# Altium project esp8266_relay.PrjPcb
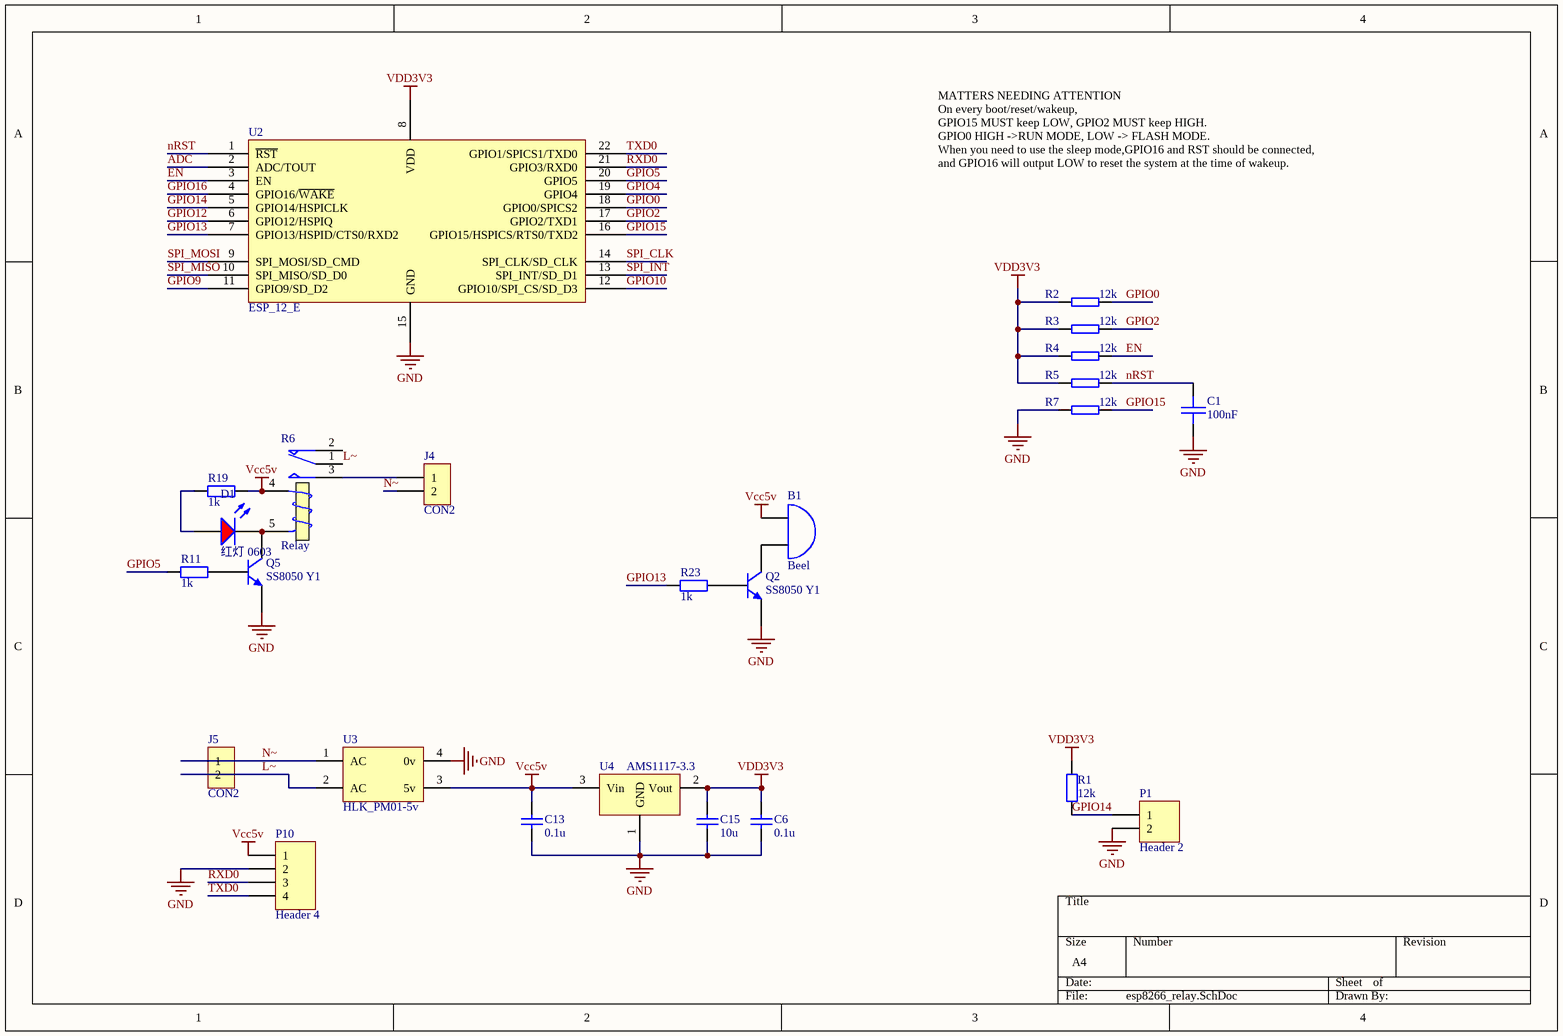
[diagram p0: esp8266_relay.SchDoc]
1 sheet, 25 parts. Net scope: global (net labels, ports and power ports of the same name join across sheets).
Board file: esp8266_relay.PcbDoc

## Sheet esp8266_relay.SchDoc
size A4

### Parts
B1  Beel  [BEEL]
C1  100nF  [C0603]
C6  0.1u  [C0603]
C13  0.1u  [C0603]
C15  10u  [C0603]
D1  红灯 0603  [0603_LED_S1]
J4  CON2  [CON_5.08_2]
J5  CON2  [CON_5.08_2]
P1  Header 2  [HDR1X2]
P10  Header 4  [HDR1X4]
Q2  SS8050 Y1  [SOT-23(SOT-23-3)]
Q5  SS8050 Y1  [SOT-23(SOT-23-3)]
R1  12k  [Res_0603]
R2  12k  [R0603]
R3  12k  [R0603]
R4  12k  [R0603]
R5  12k  [R0603]
R6  Relay  [HF3FF-JQC-3FF-005]
R7  12k  [R0603]
R11  1k  [R0603]
R19  1k  [R0603]
R23  1k  [R0603]
U2  ESP_12_E  [ESP8266]
U3  HLK_PM01-5v  [HLK_PM01-5v]
U4  AMS1117-3.3  [AMS1117]

### Nets
GND: C1.2 C6.1 C13.1 C15.1 P1.2 P10.2 Q2.2(E) Q5.2(E) R7.1 U2.15(GND) U3.4(0v) U4.1(GND)
Vcc5v: B1.1(A) C13.2 P10.1 R6.4(T1) R19.2 U3.3(5v) U4.3(Vin)
VDD3V3: C6.2 C15.2 R1.2 R2.1 R3.1 R4.1 R5.1 U2.8(VDD) U4.2(Vout)
ADC: U2.2(ADC/TOUT)
EN: R4.2 U2.3(EN)
GPIO0: R2.2 U2.18(GPIO0/SPICS2)
GPIO2: R3.2 U2.17(GPIO2/TXD1)
GPIO4: U2.19(GPIO4)
GPIO5: R11.1 U2.20(GPIO5)
GPIO9: U2.11(GPIO9/SD_D2)
GPIO10: U2.12(GPIO10/SPI_CS/SD_D3)
GPIO12: U2.6(GPIO12/HSPIQ)
GPIO13: R23.2 U2.7(GPIO13/HSPID/CTS0/RXD2)
GPIO14: P1.1 R1.1 U2.5(GPIO14/HSPICLK)
GPIO15: R7.2 U2.16(GPIO15/HSPICS/RTS0/TXD2)
GPIO16: U2.4(GPIO16/~{WAKE})
L~: J5.2 R6.1(COM) U3.2(AC)
nRST: C1.1 R5.2 U2.1(~{RST})
N~: J4.2 J5.1 U3.1(AC)
RXD0: P10.3 U2.21(GPIO3/RXD0)
SPI_CLK: U2.14(SPI_CLK/SD_CLK)
SPI_INT: U2.13(SPI_INT/SD_D1)
SPI_MISO: U2.10(SPI_MISO/SD_D0)
SPI_MOSI: U2.9(SPI_MOSI/SD_CMD)
TXD0: P10.4 U2.22(GPIO1/SPICS1/TXD0)
NetB1_2: B1.2(B) Q2.3(C)
NetD1_A: D1.A R19.1
NetD1_K: D1.K Q5.3(C) R6.5(T2)
NetJ4_1: J4.1 R6.3(NO)
NetQ2_1: Q2.1(B) R23.1
NetQ5_1: Q5.1(B) R11.2

Not connected (* = marked no-connect by the designer): R6 2(NC)

### Notes on the sheet
- MATTERS NEEDING ATTENTION
  On every boot/reset/wakeup,
  GPIO15 MUST keep LOW, GPIO2 MUST keep HIGH.
  GPIO0 HIGH ->RUN MODE, LOW -> FLASH MODE.
  When you need to use the sleep mode,GPIO16 and RST should be connected,
  and GPIO16 will output LOW to reset the system at the time of wakeup.

### Library data of the parts
C1 = SMT_C_0402: Surface mount capacitor 0402
C6 C13 C15 = Cap_0402
D1 = 0603 红灯: 发光二极管; ComponentLink1Description: 供应商链接; ComponentLink1URL: http://www.szlcsc.com/product/details_2659.html; Package: 0603; Supplier: LC; SuppliersPartNumber: C2286
J4 J5 = CON2: Connector
P1 = Header 2: Header, 2-Pin; LatestRevisionDate: 17-Jul-2002; LatestRevisionNote: Re-released for DXP Platform.; Publisher: Altium Limited
P10 = Header 4: Header, 4-Pin; LatestRevisionDate: 17-Jul-2002; LatestRevisionNote: Re-released for DXP Platform.; Publisher: Altium Limited
Q2 Q5 = SOT-23 SS8050 Y1: 三极管; ComponentLink1Description: 供应商链接; ComponentLink1URL: http://www.szlcsc.com/product/details_2507.html; Package: SOT-23; Supplier: LC; SuppliersPartNumber: C2150
R1 = Res_0603
R2-R5 R7 = SMT_R_0402: Surface mount resistor 0402
R11 R19 R23 = Res_0402
U2 = ESP_12_E: ESP-12 Wi-Fi Module by AI-Thinker; IC: ESP8266-EX; Vendor: Ai-thinker
U4 = AMS1117